# Altium schematic sheet main_board_interconnect.SchDoc
size A4
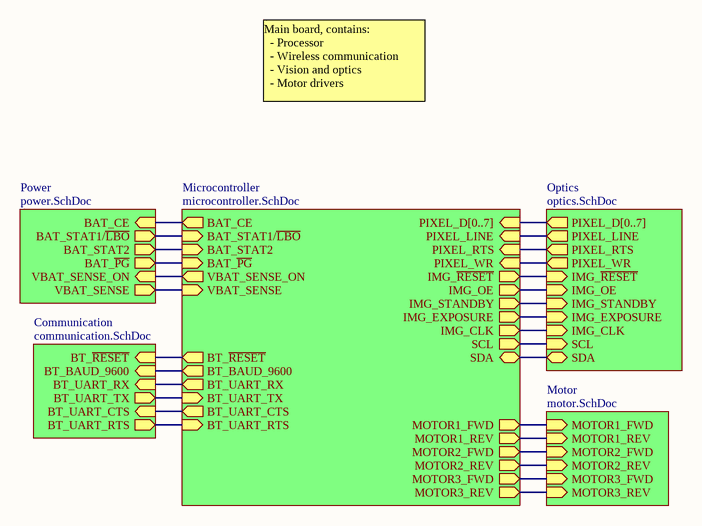
[diagram p0: main_board_interconnect.SchDoc]

## Sub-sheets
Communication = communication.SchDoc: BT_~{RESET} (in), BT_BAUD_9600 (in), BT_UART_RX (in), BT_UART_TX (out), BT_UART_CTS (in), BT_UART_RTS (out)
Microcontroller = microcontroller.SchDoc: BAT_CE (out), BAT_STAT1/~{LBO} (in), BAT_STAT2 (in), BAT_~{PG} (in), VBAT_SENSE_ON (out), VBAT_SENSE (in), BT_~{RESET} (out), BT_BAUD_9600 (out), BT_UART_RX (out), BT_UART_TX (in), BT_UART_CTS (out), BT_UART_RTS (in), MOTOR3_REV (out), MOTOR3_FWD (out), MOTOR2_REV (out), MOTOR2_FWD (out), MOTOR1_REV (out), MOTOR1_FWD (out), PIXEL_D[0..7] (in), PIXEL_LINE (in), PIXEL_RTS (in), PIXEL_WR (in), IMG_~{RESET} (out), IMG_OE (out), IMG_STANDBY (out), IMG_EXPOSURE (out), IMG_CLK (out), SDA (bidir), SCL (out)
Motor = motor.SchDoc: MOTOR3_REV (in), MOTOR3_FWD (in), MOTOR2_REV (in), MOTOR2_FWD (in), MOTOR1_REV (in), MOTOR1_FWD (in)
Optics = optics.SchDoc: PIXEL_D[0..7] (out), PIXEL_LINE (out), PIXEL_RTS (out), PIXEL_WR (out), IMG_~{RESET} (in), IMG_OE (in), IMG_STANDBY (in), IMG_EXPOSURE (in), IMG_CLK (in), SDA (bidir), SCL (in)
Power = power.SchDoc: BAT_CE (in), BAT_STAT1/~{LBO} (out), BAT_STAT2 (out), BAT_~{PG} (out), VBAT_SENSE_ON (in), VBAT_SENSE (out)

## Nets
(unnamed): sheet Microcontroller/BAT_CE, sheet Power/BAT_CE
(unnamed): sheet Microcontroller/BAT_STAT1/~{LBO}, sheet Power/BAT_STAT1/~{LBO}
(unnamed): sheet Microcontroller/BAT_STAT2, sheet Power/BAT_STAT2
(unnamed): sheet Microcontroller/BAT_~{PG}, sheet Power/BAT_~{PG}
(unnamed): sheet Microcontroller/VBAT_SENSE_ON, sheet Power/VBAT_SENSE_ON
(unnamed): sheet Microcontroller/VBAT_SENSE, sheet Power/VBAT_SENSE
(unnamed): sheet Microcontroller/BT_~{RESET}, sheet Communication/BT_~{RESET}
(unnamed): sheet Microcontroller/BT_BAUD_9600, sheet Communication/BT_BAUD_9600
(unnamed): sheet Microcontroller/BT_UART_RX, sheet Communication/BT_UART_RX
(unnamed): sheet Microcontroller/BT_UART_TX, sheet Communication/BT_UART_TX
(unnamed): sheet Microcontroller/BT_UART_CTS, sheet Communication/BT_UART_CTS
(unnamed): sheet Microcontroller/BT_UART_RTS, sheet Communication/BT_UART_RTS
(unnamed): sheet Microcontroller/MOTOR3_REV, sheet Motor/MOTOR3_REV
(unnamed): sheet Microcontroller/MOTOR3_FWD, sheet Motor/MOTOR3_FWD
(unnamed): sheet Microcontroller/MOTOR2_REV, sheet Motor/MOTOR2_REV
(unnamed): sheet Microcontroller/MOTOR2_FWD, sheet Motor/MOTOR2_FWD
(unnamed): sheet Microcontroller/MOTOR1_REV, sheet Motor/MOTOR1_REV
(unnamed): sheet Microcontroller/MOTOR1_FWD, sheet Motor/MOTOR1_FWD
(unnamed): sheet Microcontroller/PIXEL_LINE, sheet Optics/PIXEL_LINE
(unnamed): sheet Microcontroller/PIXEL_RTS, sheet Optics/PIXEL_RTS
(unnamed): sheet Microcontroller/PIXEL_WR, sheet Optics/PIXEL_WR
(unnamed): sheet Microcontroller/IMG_~{RESET}, sheet Optics/IMG_~{RESET}
(unnamed): sheet Microcontroller/IMG_OE, sheet Optics/IMG_OE
(unnamed): sheet Microcontroller/IMG_STANDBY, sheet Optics/IMG_STANDBY
(unnamed): sheet Microcontroller/IMG_EXPOSURE, sheet Optics/IMG_EXPOSURE
(unnamed): sheet Microcontroller/IMG_CLK, sheet Optics/IMG_CLK
(unnamed): sheet Microcontroller/SDA, sheet Optics/SDA
(unnamed): sheet Microcontroller/SCL, sheet Optics/SCL

## Buses and harness runs
bus sheet Microcontroller/PIXEL_D[0..7] = sheet Optics/PIXEL_D[0..7]

## Notes on the sheet
- Main board, contains:
  - Processor
  - Wireless communication
  - Vision and optics
  - Motor drivers